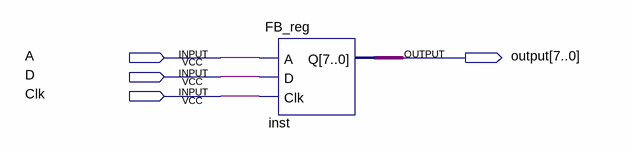
[diagram p0: schematic sheet]
// Quartus schematic Block1.bdf as structural Verilog: 1 symbols, 4 pins
module Block1 (
  input  A,
  input  D,
  input  Clk,
  output [7:0] \output 
);

  FB_reg inst (.A(A), .D(D), .Clk(Clk), .Q(\output ));
endmodule
